# EAGLE design DroneMainBoard (EAGLE 9.6.2)

## Sheet 1 of 5
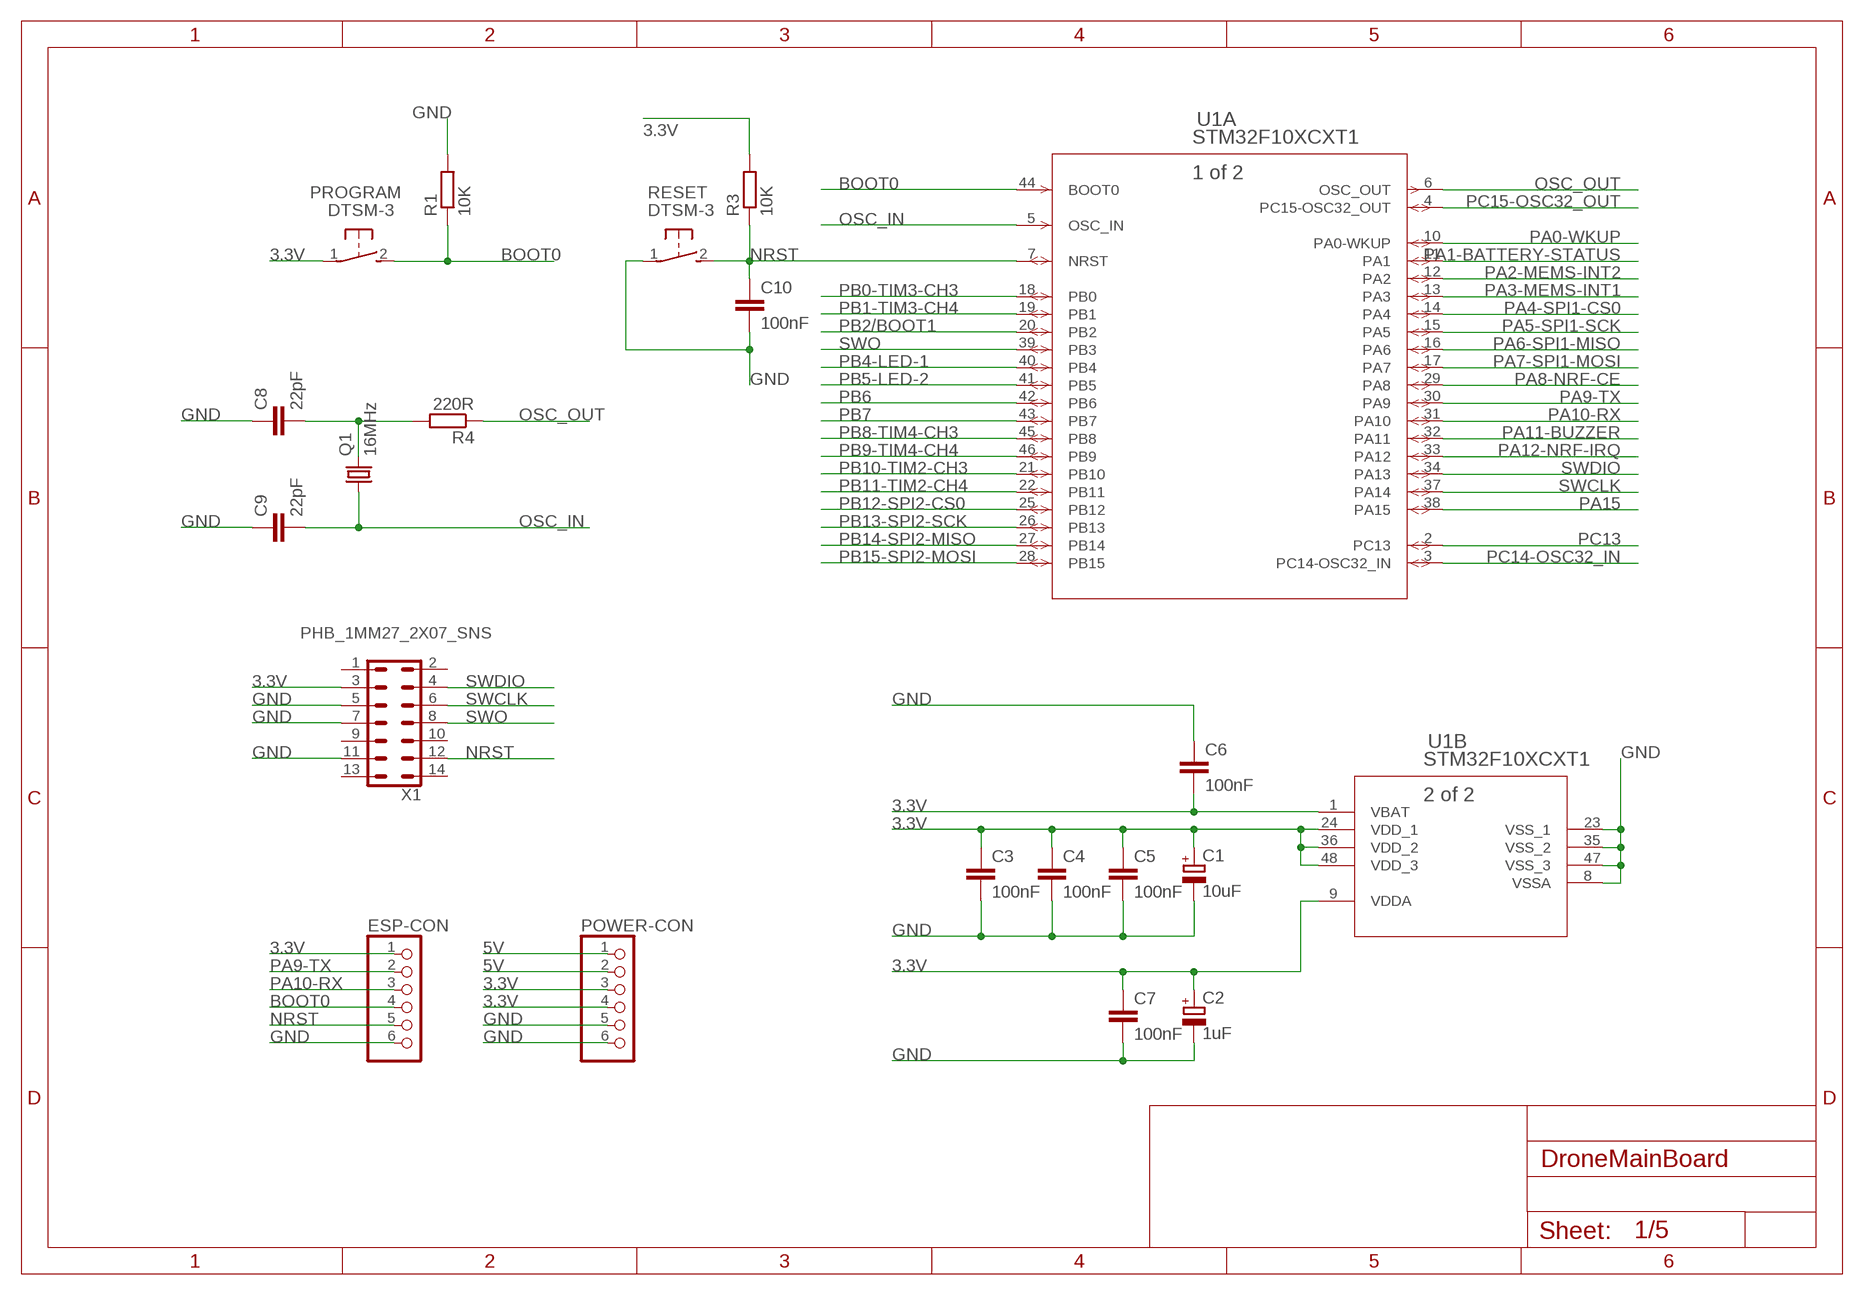
[diagram p0: schematic, sheet 1]

### Parts
C1  10uF  CPOL-EUSMCA  [SMC_A]
C2  1uF  CPOL-EUSMCA  [SMC_A]
C3  100nF  C-EUC0603  [C0603]
C4  100nF  C-EUC0603  [C0603]
C5  100nF  C-EUC0603  [C0603]
C6  100nF  C-EUC0603  [C0603]
C7  100nF  C-EUC0603  [C0603]
C8  22pF  C-EUC0603  [C0603]
C9  22pF  C-EUC0603  [C0603]
C10  100nF  C-EUC0603  [C0603]
ESP-CON  PINHD-1X6  [1X06]
POWER-CON  PINHD-1X6  [1X06]
PROGRAM  DTSM-3  [DTSM-3]
Q1  16MHz  CRYSTALHC49S  [HC49/S]
R1  10K  R-EU_R0603  [R0603]
R3  10K  R-EU_R0603  [R0603]
R4  220R  R-EU_R0603  [R0603]
RESET  DTSM-3  [DTSM-3]
U1  STM32F10XCXT1  [LQFP48-7X7MM]
X1  PHB_1MM27_2X07_SNS  [PHB_1MM27_2X07_SNS]

### Nets
3.3V: C1.+ C2.+ C3.1 C4.1 C5.1 C6.2 C7.1 ESP-CON.1 POWER-CON.3 POWER-CON.4 PROGRAM.1 R3.2 U1.1(B:VBAT) U1.9(B:VDDA) U1.24(B:VDD_1) U1.36(B:VDD_2) U1.48(B:VDD_3) X1.3 ; also sheet 2,3
5V: POWER-CON.1 POWER-CON.2 ; also sheet 5
BOOT0: ESP-CON.4 PROGRAM.2 R1.1 U1.44(A:BOOT0)
GND: C1.- C2.- C3.2 C4.2 C5.2 C6.1 C7.2 C8.1 C9.1 C10.2 ESP-CON.6 POWER-CON.5 POWER-CON.6 R1.2 RESET.1 U1.8(B:VSSA) U1.23(B:VSS_1) U1.35(B:VSS_2) U1.47(B:VSS_3) X1.5 X1.7 X1.11 ; also sheet 2,3,4,5
N$5: C8.2 Q1.2 R4.2
NRST: C10.1 ESP-CON.5 R3.1 RESET.2 U1.7(A:NRST) X1.12
OSC_IN: C9.2 Q1.1 U1.5(A:OSC_IN)
OSC_OUT: R4.1 U1.6(A:OSC_OUT)
PA0-WKUP: U1.10(A:PA0-WKUP)
PA1-BATTERY-STATUS: U1.11(A:PA1) ; also sheet 4
PA2-MEMS-INT2: U1.12(A:PA2) ; also sheet 3
PA3-MEMS-INT1: U1.13(A:PA3) ; also sheet 3
PA4-SPI1-CS0: U1.14(A:PA4) ; also sheet 3
PA5-SPI1-SCK: U1.15(A:PA5) ; also sheet 3
PA6-SPI1-MISO: U1.16(A:PA6) ; also sheet 3
PA7-SPI1-MOSI: U1.17(A:PA7) ; also sheet 3
PA8-NRF-CE: U1.29(A:PA8) ; also sheet 2
PA9-TX: ESP-CON.2 U1.30(A:PA9)
PA10-RX: ESP-CON.3 U1.31(A:PA10)
PA11-BUZZER: U1.32(A:PA11) ; also sheet 5
PA12-NRF-IRQ: U1.33(A:PA12) ; also sheet 2
PA15: U1.38(A:PA15)
PB0-TIM3-CH3: U1.18(A:PB0)
PB1-TIM3-CH4: U1.19(A:PB1)
PB2/BOOT1: U1.20(A:PB2)
PB4-LED-1: U1.40(A:PB4) ; also sheet 5
PB5-LED-2: U1.41(A:PB5) ; also sheet 5
PB6: U1.42(A:PB6)
PB7: U1.43(A:PB7)
PB8-TIM4-CH3: U1.45(A:PB8) ; also sheet 5
PB9-TIM4-CH4: U1.46(A:PB9) ; also sheet 5
PB10-TIM2-CH3: U1.21(A:PB10) ; also sheet 5
PB11-TIM2-CH4: U1.22(A:PB11) ; also sheet 5
PB12-SPI2-CS0: U1.25(A:PB12) ; also sheet 2
PB13-SPI2-SCK: U1.26(A:PB13) ; also sheet 2
PB14-SPI2-MISO: U1.27(A:PB14) ; also sheet 2
PB15-SPI2-MOSI: U1.28(A:PB15) ; also sheet 2
PC13: U1.2(A:PC13)
PC14-OSC32_IN: U1.3(A:PC14-OSC32_IN)
PC15-OSC32_OUT: U1.4(A:PC15-OSC32_OUT)
SWCLK: U1.37(A:PA14) X1.6
SWDIO: U1.34(A:PA13) X1.4
SWO: U1.39(A:PB3) X1.8
Unconnected: X1.1 X1.2 X1.9 X1.10 X1.13 X1.14

## Sheet 2 of 5
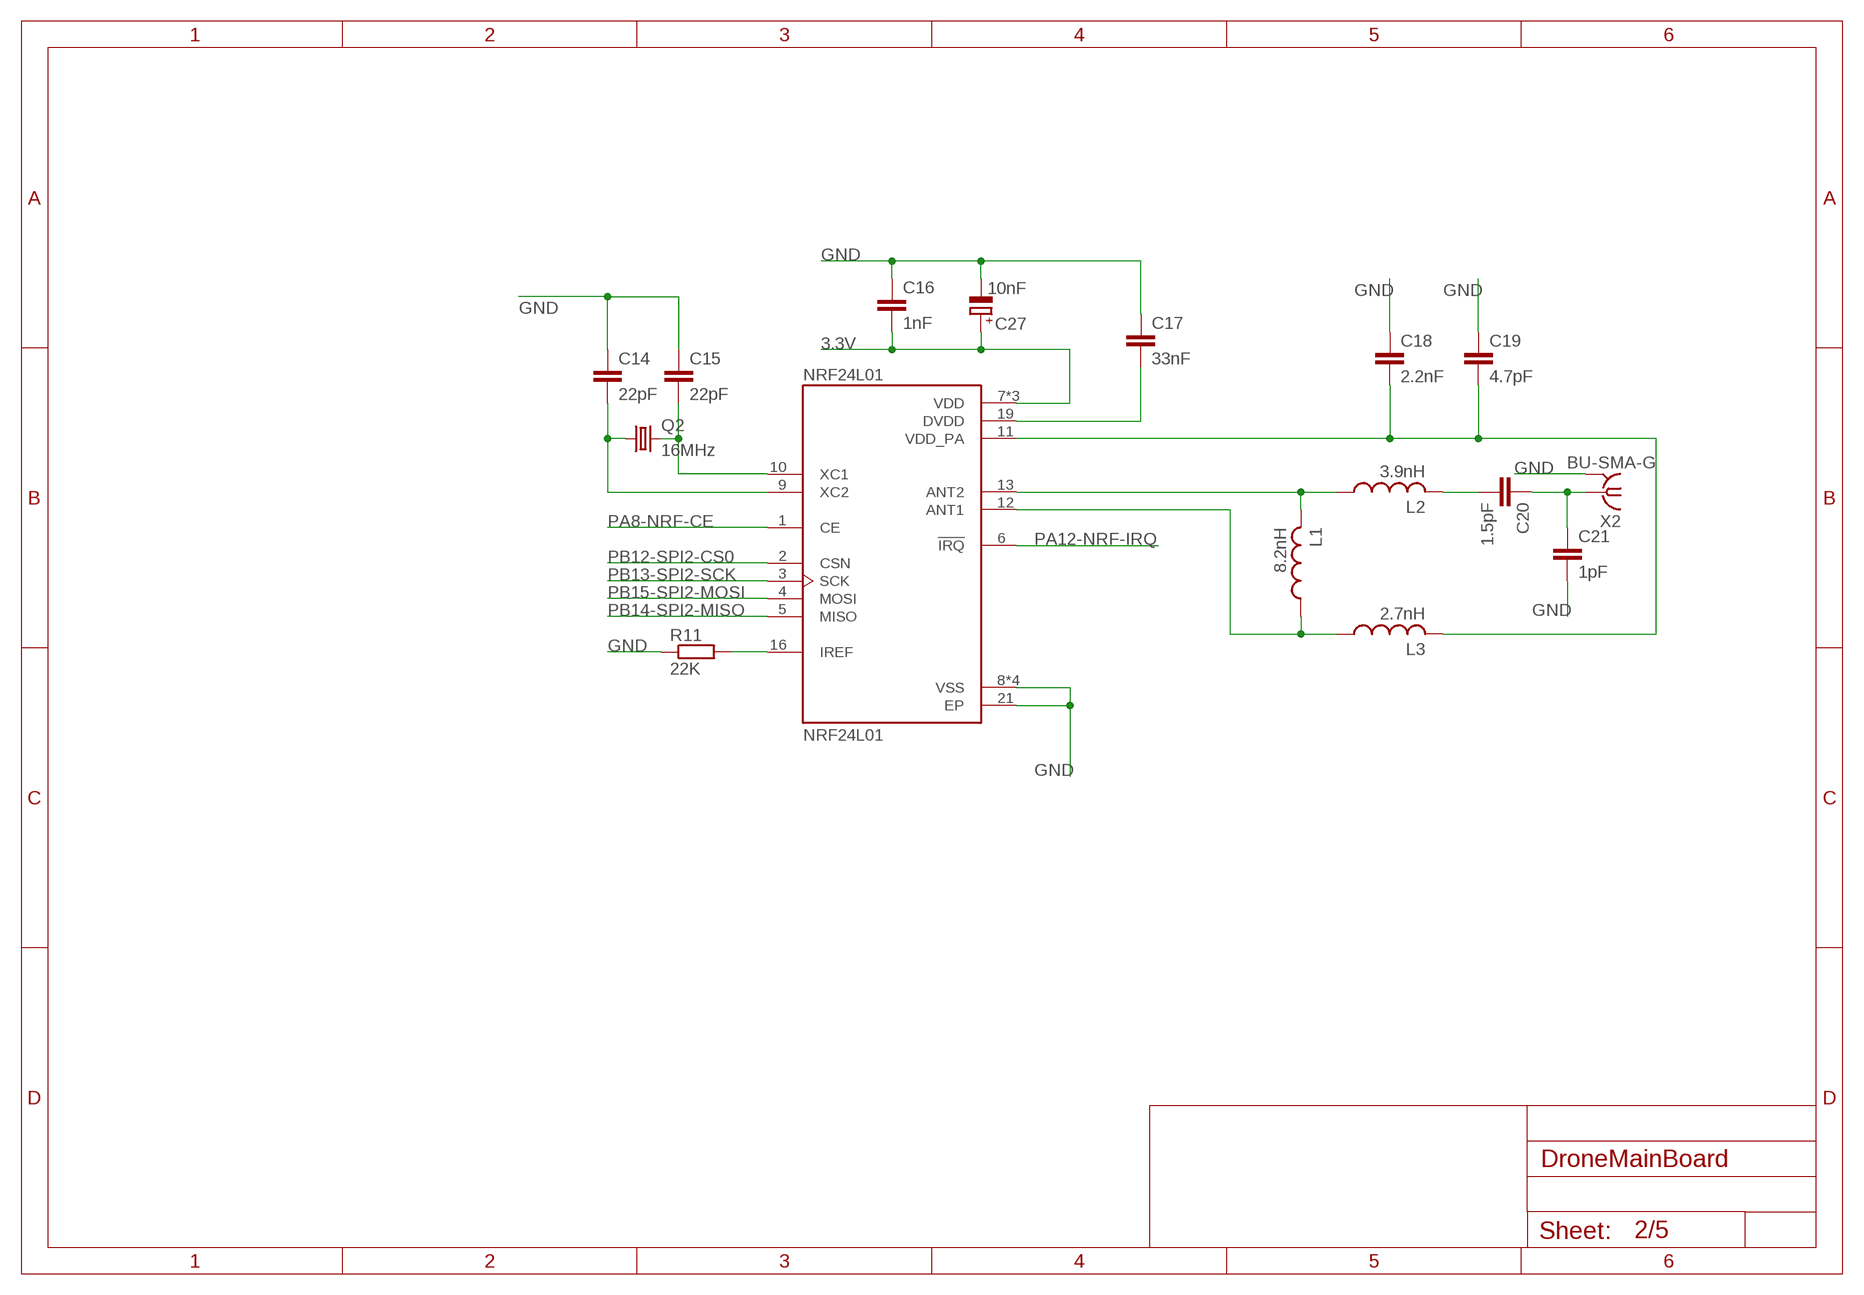
[diagram p1: schematic, sheet 2]

### Parts
C14  22pF  C-EUC0603  [C0603]
C15  22pF  C-EUC0603  [C0603]
C16  1nF  C-EUC0603  [C0603]
C17  33nF  C-EUC0603  [C0603]
C18  2.2nF  C-EUC0603  [C0603]
C19  4.7pF  C-EUC0603  [C0603]
C20  1.5pF  C-EUC0603  [C0603]
C21  1pF  C-EUC0603  [C0603]
C27  10nF  CPOL-EUSMCA  [SMC_A]
L1  8.2nH  L-USL2012C  [L2012C]
L2  3.9nH  L-USL2012C  [L2012C]
L3  2.7nH  L-USL2012C  [L2012C]
NRF24L01  NRF24L01  [QFN50P400X400X95-21N]
Q2  16MHz  CRYSTALHC49S  [HC49/S]
R11  22K  R-EU_R0603  [R0603]
X2  BU-SMA-G  [BU-SMA-G]

### Nets
3.3V: C16.2 C27.+ NRF24L01.7(VDD) NRF24L01.15(VDD) NRF24L01.18(VDD) ; also sheet 1,3
GND: C14.1 C15.1 C16.1 C17.1 C18.1 C19.1 C21.2 C27.- NRF24L01.8(VSS) NRF24L01.14(VSS) NRF24L01.17(VSS) NRF24L01.20(VSS) NRF24L01.21(EP) R11.1 X2.2 X2.3 X2.4 X2.5 ; also sheet 1,3,4,5
N$7: NRF24L01.16(IREF) R11.2
N$8: C17.2 NRF24L01.19(DVDD)
N$9: L1.2 L2.1 NRF24L01.13(ANT2)
N$10: L1.1 L3.1 NRF24L01.12(ANT1)
N$11: C18.2 C19.2 L3.2 NRF24L01.11(VDD_PA)
N$12: C14.2 NRF24L01.9(XC2) Q2.1
N$13: C15.2 NRF24L01.10(XC1) Q2.2
N$14: C20.1 C21.1 X2.1
N$15: C20.2 L2.2
PA8-NRF-CE: NRF24L01.1(CE) ; also sheet 1
PA12-NRF-IRQ: NRF24L01.6(!IRQ) ; also sheet 1
PB12-SPI2-CS0: NRF24L01.2(CSN) ; also sheet 1
PB13-SPI2-SCK: NRF24L01.3(SCK) ; also sheet 1
PB14-SPI2-MISO: NRF24L01.5(MISO) ; also sheet 1
PB15-SPI2-MOSI: NRF24L01.4(MOSI) ; also sheet 1

## Sheet 3 of 5
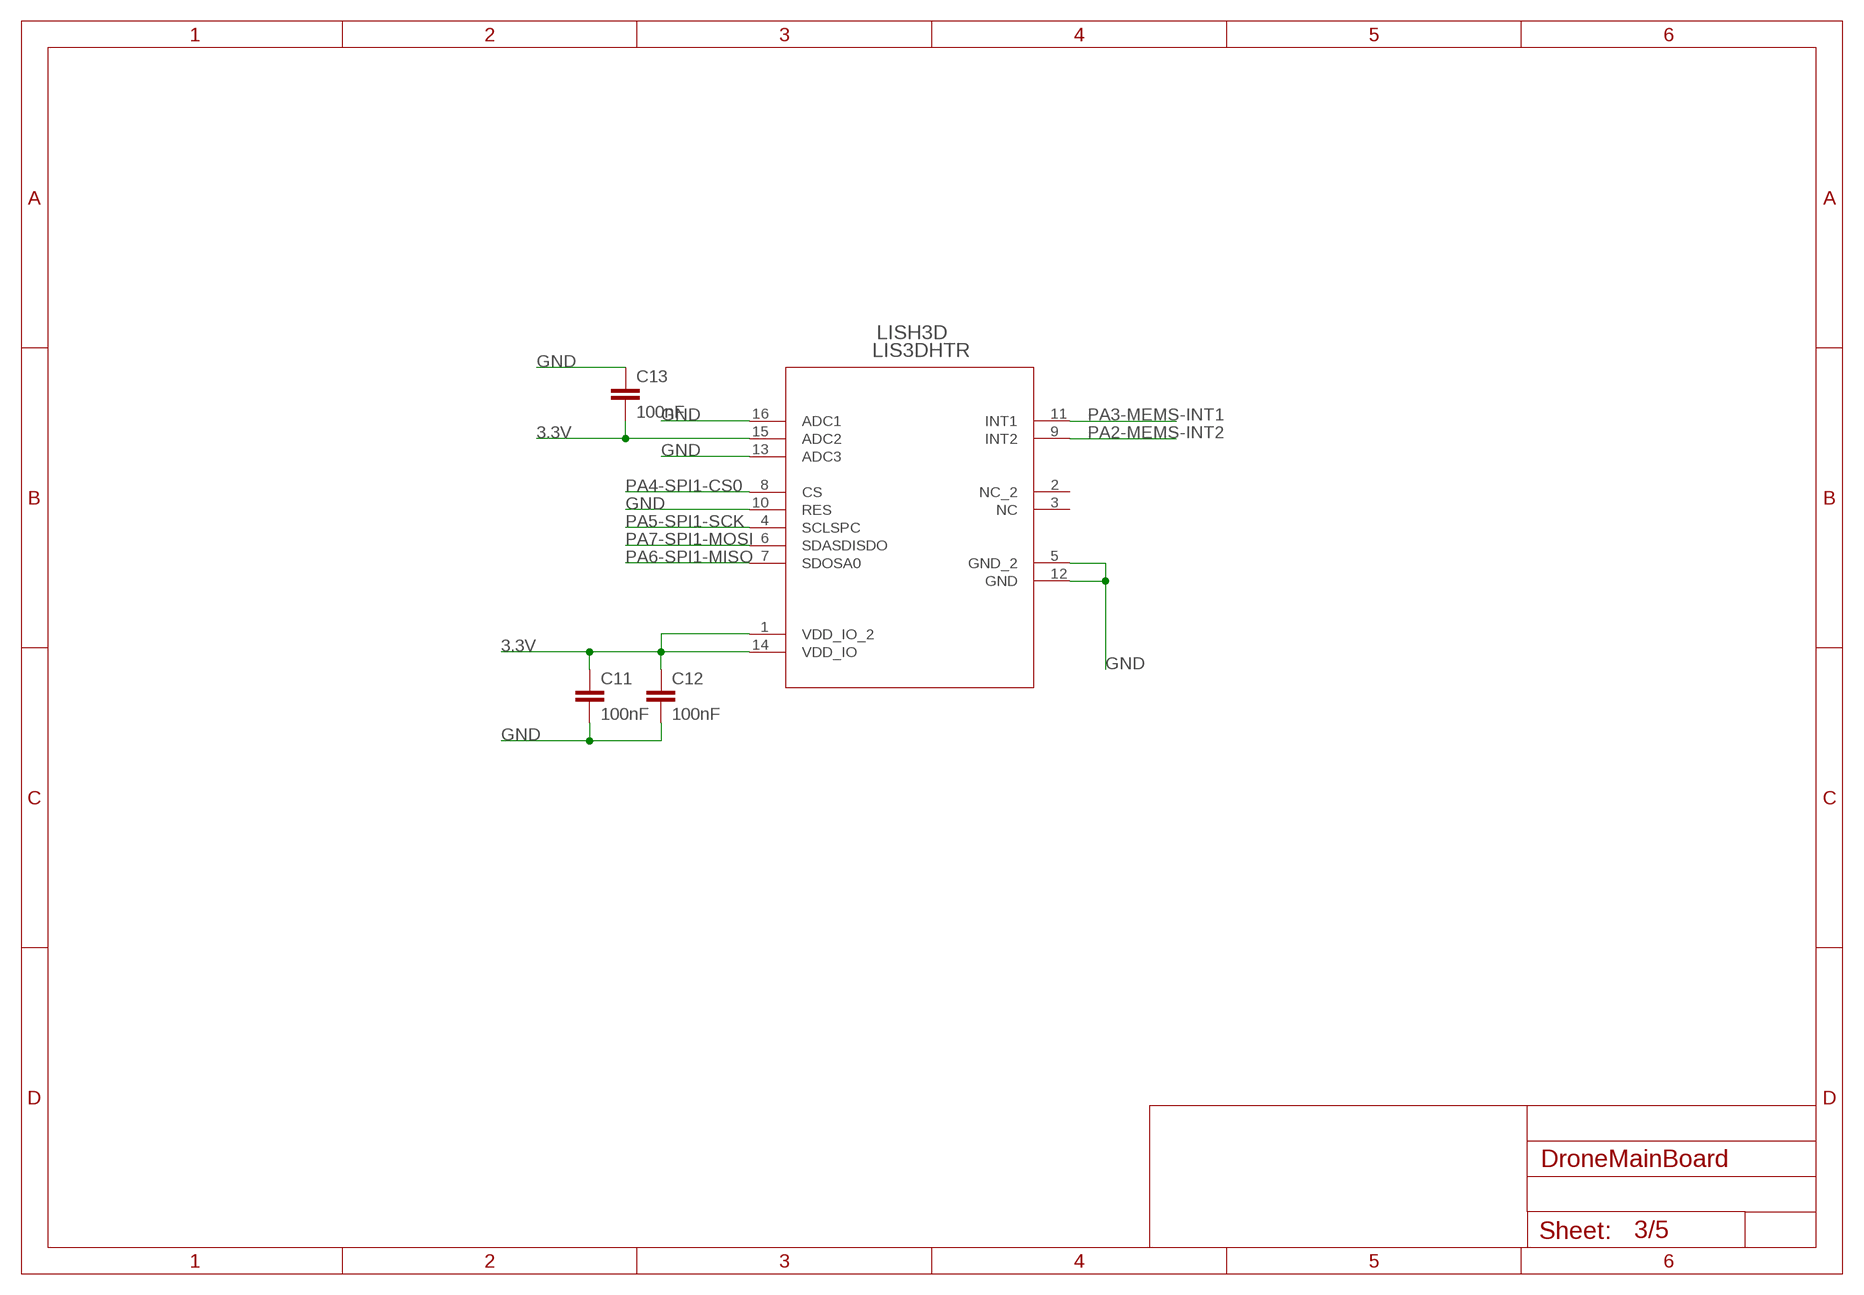
[diagram p2: schematic, sheet 3]

### Parts
C11  100nF  C-EUC0603  [C0603]
C12  100nF  C-EUC0603  [C0603]
C13  100nF  C-EUC0603  [C0603]
LISH3D  LIS3DHTR  [LGA-16_3X3X1MM_STM]

### Nets
3.3V: C11.1 C12.1 C13.2 LISH3D.1(VDD_IO_2) LISH3D.14(VDD_IO) LISH3D.15(ADC2) ; also sheet 1,2
GND: C11.2 C12.2 C13.1 LISH3D.5(GND_2) LISH3D.10(RES) LISH3D.12(GND) LISH3D.13(ADC3) LISH3D.16(ADC1) ; also sheet 1,2,4,5
PA2-MEMS-INT2: LISH3D.9(INT2) ; also sheet 1
PA3-MEMS-INT1: LISH3D.11(INT1) ; also sheet 1
PA4-SPI1-CS0: LISH3D.8(CS) ; also sheet 1
PA5-SPI1-SCK: LISH3D.4(SCLSPC) ; also sheet 1
PA6-SPI1-MISO: LISH3D.7(SDOSA0) ; also sheet 1
PA7-SPI1-MOSI: LISH3D.6(SDASDISDO) ; also sheet 1
Unconnected: LISH3D.2(NC_2) LISH3D.3(NC)

## Sheet 4 of 5
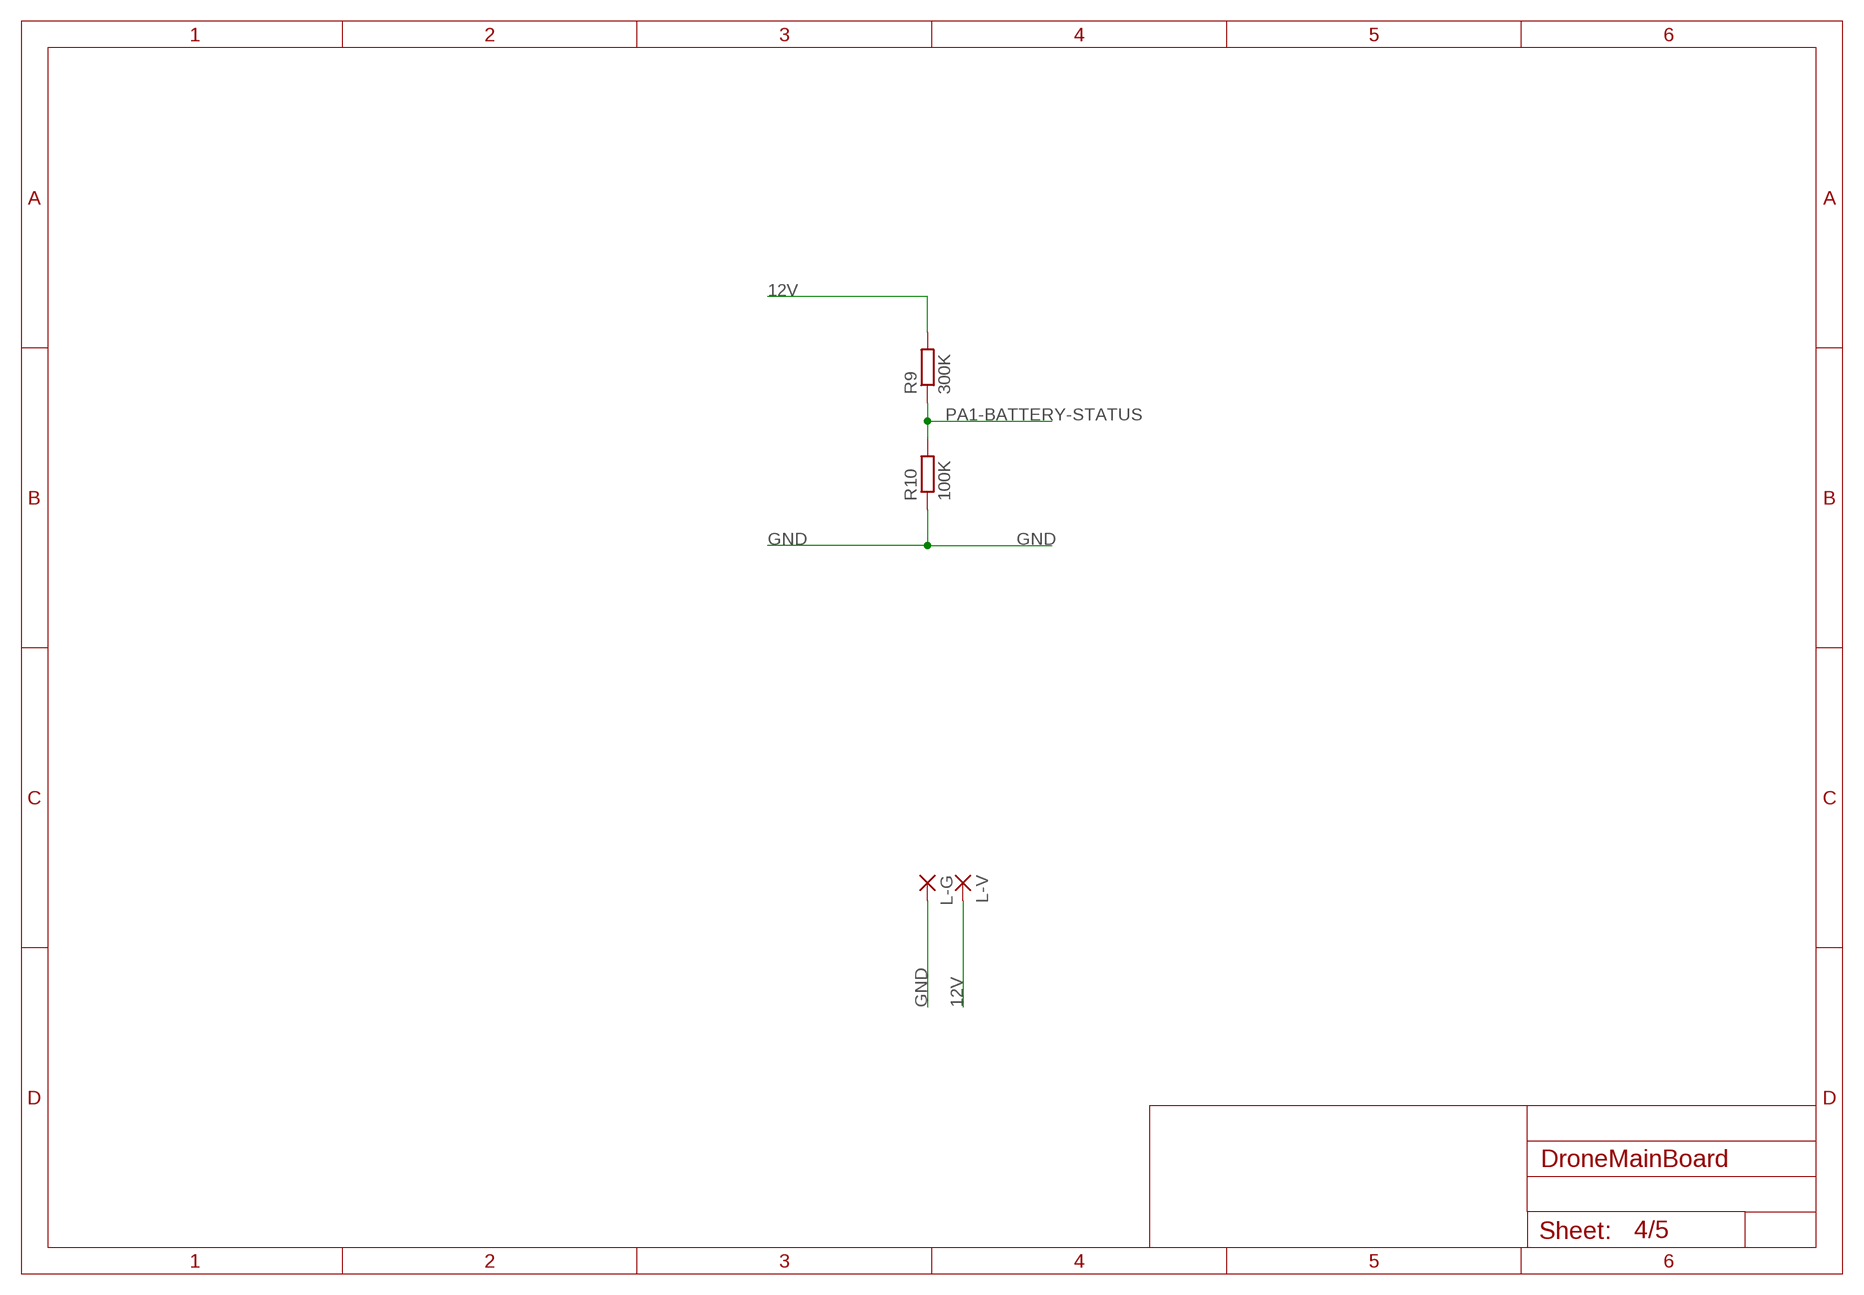
[diagram p3: schematic, sheet 4]

### Parts
L-G  2,54/1,1  [2,54/1,1]
L-V  2,54/1,1  [2,54/1,1]
R9  300K  R-EU_R0603  [R0603]
R10  100K  R-EU_R0603  [R0603]

### Nets
12V: L-V.1(P) R9.2
GND: L-G.1(P) R10.1 ; also sheet 1,2,3,5
PA1-BATTERY-STATUS: R9.1 R10.2 ; also sheet 1

## Sheet 5 of 5
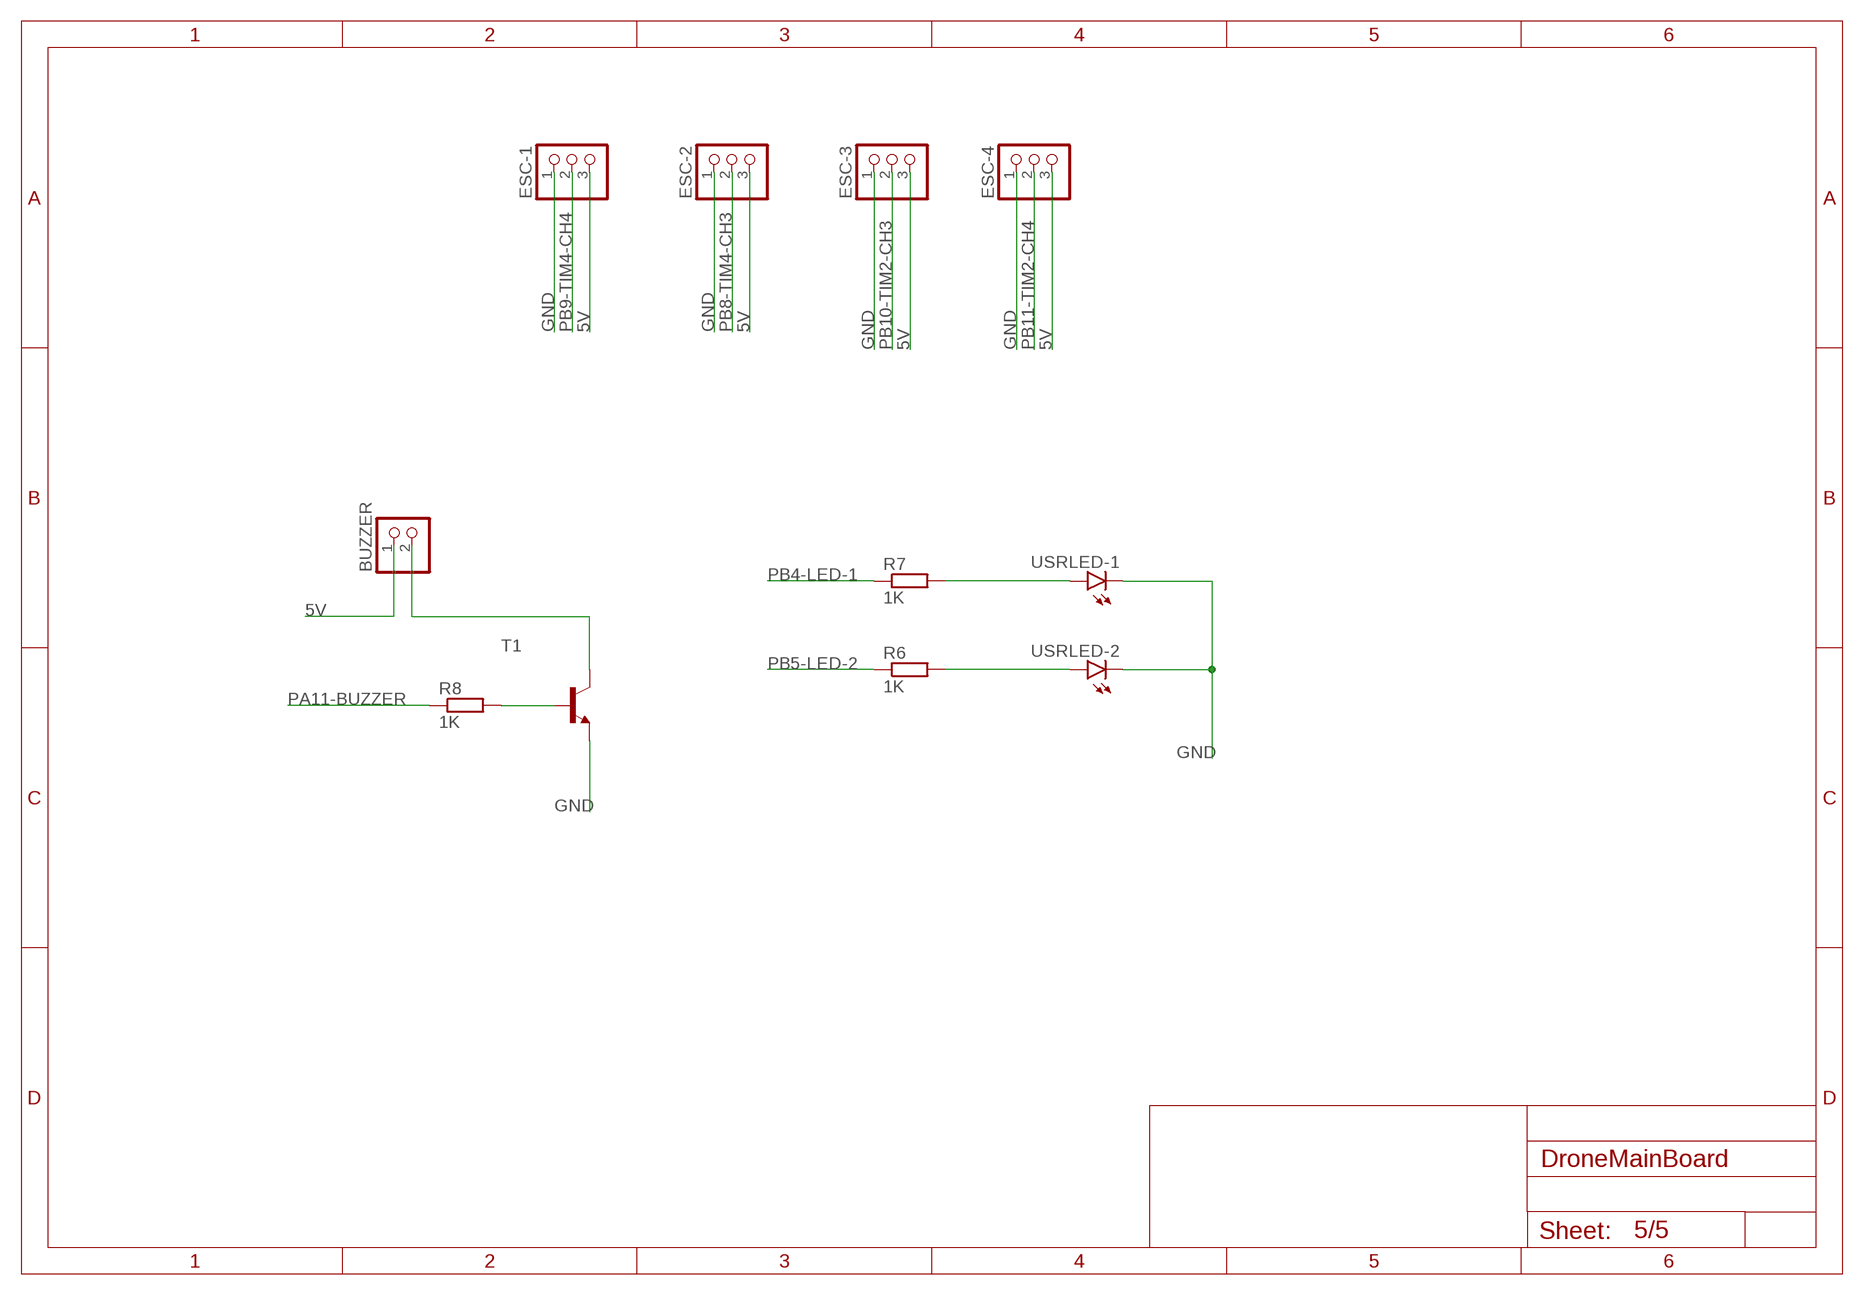
[diagram p4: schematic, sheet 5]

### Parts
BUZZER  PINHD-1X2  [1X02]
ESC-1  PINHD-1X3  [1X03]
ESC-2  PINHD-1X3  [1X03]
ESC-3  PINHD-1X3  [1X03]
ESC-4  PINHD-1X3  [1X03]
R6  1K  R-EU_R0603  [R0603]
R7  1K  R-EU_R0603  [R0603]
R8  1K  R-EU_R0603  [R0603]
T1  MMBT3904LT1-NPN-SOT23-BEC  [SOT23-BEC]
USRLED-1  LEDCHIP-LED0805  [CHIP-LED0805]
USRLED-2  LEDCHIP-LED0805  [CHIP-LED0805]

### Nets
5V: BUZZER.1 ESC-1.3 ESC-2.3 ESC-3.3 ESC-4.3 ; also sheet 1
GND: ESC-1.1 ESC-2.1 ESC-3.1 ESC-4.1 T1.E USRLED-1.C USRLED-2.C ; also sheet 1,2,3,4
N$3: R6.2 USRLED-2.A
N$4: R7.2 USRLED-1.A
N$16: BUZZER.2 T1.C
N$17: R8.2 T1.B
PA11-BUZZER: R8.1 ; also sheet 1
PB4-LED-1: R7.1 ; also sheet 1
PB5-LED-2: R6.1 ; also sheet 1
PB8-TIM4-CH3: ESC-2.2 ; also sheet 1
PB9-TIM4-CH4: ESC-1.2 ; also sheet 1
PB10-TIM2-CH3: ESC-3.2 ; also sheet 1
PB11-TIM2-CH4: ESC-4.2 ; also sheet 1

## Library data of the parts
BUZZER = pinhead:PINHD-1X2: PIN HEADER
C1 C2 C27 = rcl:CPOL-EU: POLARIZED CAPACITOR, European symbol; SPICEPREFIX: C
C3-C21 = rcl:C-EU: CAPACITOR, European symbol; SPICEPREFIX: C
ESC-1-ESC-4 = pinhead:PINHD-1X3: PIN HEADER
ESP-CON POWER-CON = pinhead:PINHD-1X6: PIN HEADER
L1-L3 = rcl:L-US: INDUCTOR, American symbol; SPICEPREFIX: L
L-G L-V = wirepad:2,54/1,1: THROUGH-HOLE PAD
LISH3D = LIS3DH:LIS3DHTR; BUILT_BY: EMA_UL_Team; MANUFACTURER_PART_NUMBER: LIS3DHTR; SOURCELIBRARY: StMicro_2015-03-30; VENDOR: STMicroelectronics
NRF24L01 = NRF24L01:NRF24L01: The nRF24L01 is a single chip 2.4GHz transceiver with an embedded baseband protocol engine (Enhanced ShockBurst™), designed for ultra low power wireless applications. The nRF24L01 is designed for operation in the world wide ISM frequency band at 2.400 - 2.4835GHz. An MCU (microcontroller) and very few external passive components are needed to design a radio system with the nRF24L01. The nRF24L01 is configured and operated through a Serial Peripheral Interface (SPI.) Through this interface the register map is available. The register map contains all configuration registers in the nRF24L01 and is accessible in all operation modes of the chip. Buy Part <https://snapeda.com/parts/NRF24L01/Nordic/view-part/?ref=eda>; AVAILABILITY: Warning; DESCRIPTION: IC RF TxRx Only General ISM > 1GHZ 2.4GHz 20-VFQFN Exposed Pad; MF: Nordic; MOUSER-PURCHASE-URL: https://snapeda.com/shop?store=Mouser&id=44833; MP: NRF24L01; PACKAGE: VFQFN-20 Nordic Semiconductor; PRICE: None
PROGRAM RESET = switch-tact:DTSM-3
Q1 Q2 = crystal:CRYSTAL: CRYSTAL; OC_FARNELL: 1667008; OC_NEWARK: unknown
R1 R3 R4 R6-R11 = rcl:R-EU_: RESISTOR, European symbol; SPICEPREFIX: R
T1 = transistor:*-NPN-: NPN Transistror BF959 corrected 2008.03.06
U1 = STM32F10XCXT1:STM32F10XCXT1; COPYRIGHT: Copyright (C) 2016 Accelerated Designs. All rights reserved; MANUFACTURER_PART_NUMBER: STM32F10XCXT1; VENDOR: STMicroelectronics
USRLED-1 USRLED-2 = led:LED: LED OSRAM: - CHIPLED LG R971, LG N971, LY N971, LG Q971, LY Q971, LO R971, LY R971 LH N974, LH R974 LS Q976, LO Q976, LY Q976 LO Q996 - Hyper CHIPLED LW Q18S LB Q993, LB Q99A, LB R99A - SideLED LS A670, LO A670, LY A670, LG A670, LP A670 LB A673, LV A673, LT A673, LW A673 LH A674 LY A675 LS A676, LA A676, LO A676, LY A676, LW A676 LS A679, LY A679, LG A679 - Hyper Micro SIDELED® LS Y876, LA Y876, LO Y876, LY Y876 LT Y87S - SmartLED LW L88C, LW L88S LB L89C, LB L89S, LG L890 LS L89K, LO L89K, LY L89K LS L896, LA L896, LO L896, LY L896 - TOPLED LS T670, LO T670, LY T670, LG T670, LP T670 LSG T670, LSP T670, LSY T670, LOP T670, LYG T670 LG T671, LOG T671, LSG T671 LB T673, LV T673, LT T673, LW T673 LH T674 LS T676, LA T676, LO T676, LY T676, LB T676, LH T676, LSB T676, LW T676 LB T67C, LV T67C, LT T67C, LS T67K, LO T67K, LY T67K, LW E67C LS E67B, LA E67B, LO E67B, LY E67B, LB E67C, LV E67C, LT E67C LW T67C LS T679, LY T679, LG T679 LS T770, LO T770, LY T770, LG T770, LP T770 LB T773, LV T773, LT T773, LW T773 LH T774 LS E675, LA E675, LY E675, LS T675 LS T776, LA T776, LO T776, LY T776, LB T776 LHGB T686 LT T68C, LB T68C - Hyper Mini TOPLED® LB M676 - Mini TOPLED Santana® LG M470 LS M47K, LO M47K, LY M47K Source: http://www.osram.convergy.de LUXEON: - LUMILED® LXK2-PW12-R00, LXK2-PW12-S00, LXK2-PW14-U00, LXK2-PW14-V00 LXK2-PM12-R00, LXK2-PM12-S00, LXK2-PM14-U00 LXK2-PE12-Q00, LXK2-PE12-R00, LXK2-PE12-S00, LXK2-PE14-T00, LXK2-PE14-U00 LXK2-PB12-K00, LXK2-PB12-L00, LXK2-PB12-M00, LXK2-PB14-N00, LXK2-PB14-P00, LXK2-PB14-Q00 LXK2-PR12-L00, LXK2-PR12-M00, LXK2-PR14-Q00, LXK2-PR14-R00 LXK2-PD12-Q00, LXK2-PD12-R00, LXK2-PD12-S00 LXK2-PH12-R00, LXK2-PH12-S00 LXK2-PL12-P00, LXK2-PL12-Q00, LXK2-PL12-R00 Source: www.luxeon.com KINGBRIGHT: KA-3528ASYC Source: www.kingbright.com
X1 = pinhead-box-1.27mm:PHB_1MM27_2X07_*: Pin Header Box-Type, 1.27mm/0.5"/50mil Pitch, 2x07 Circuits Note: see library description for an important note about THT-version
X2 = con-coax:BU-SMA-G: FEMALE SMA CONNECTOR Radiall distributor RS 193-9117; OC_FARNELL: unknown; OC_NEWARK: unknown

## Board
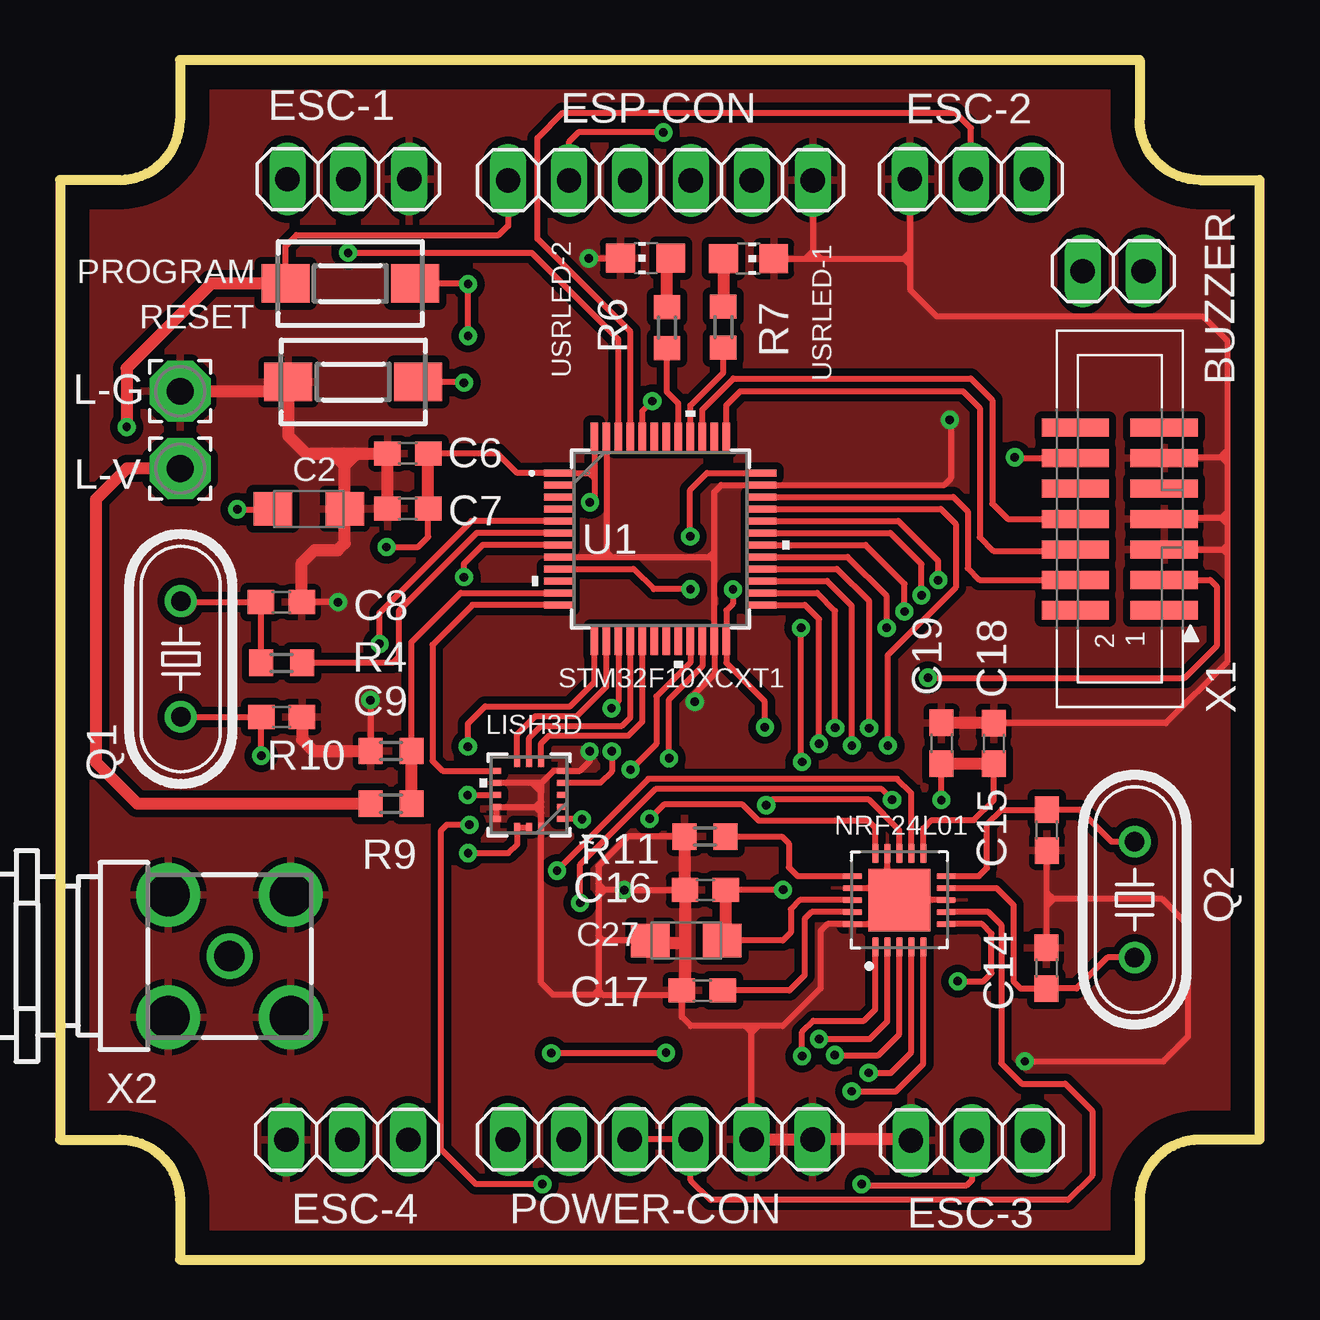
[diagram p5: board, top side]
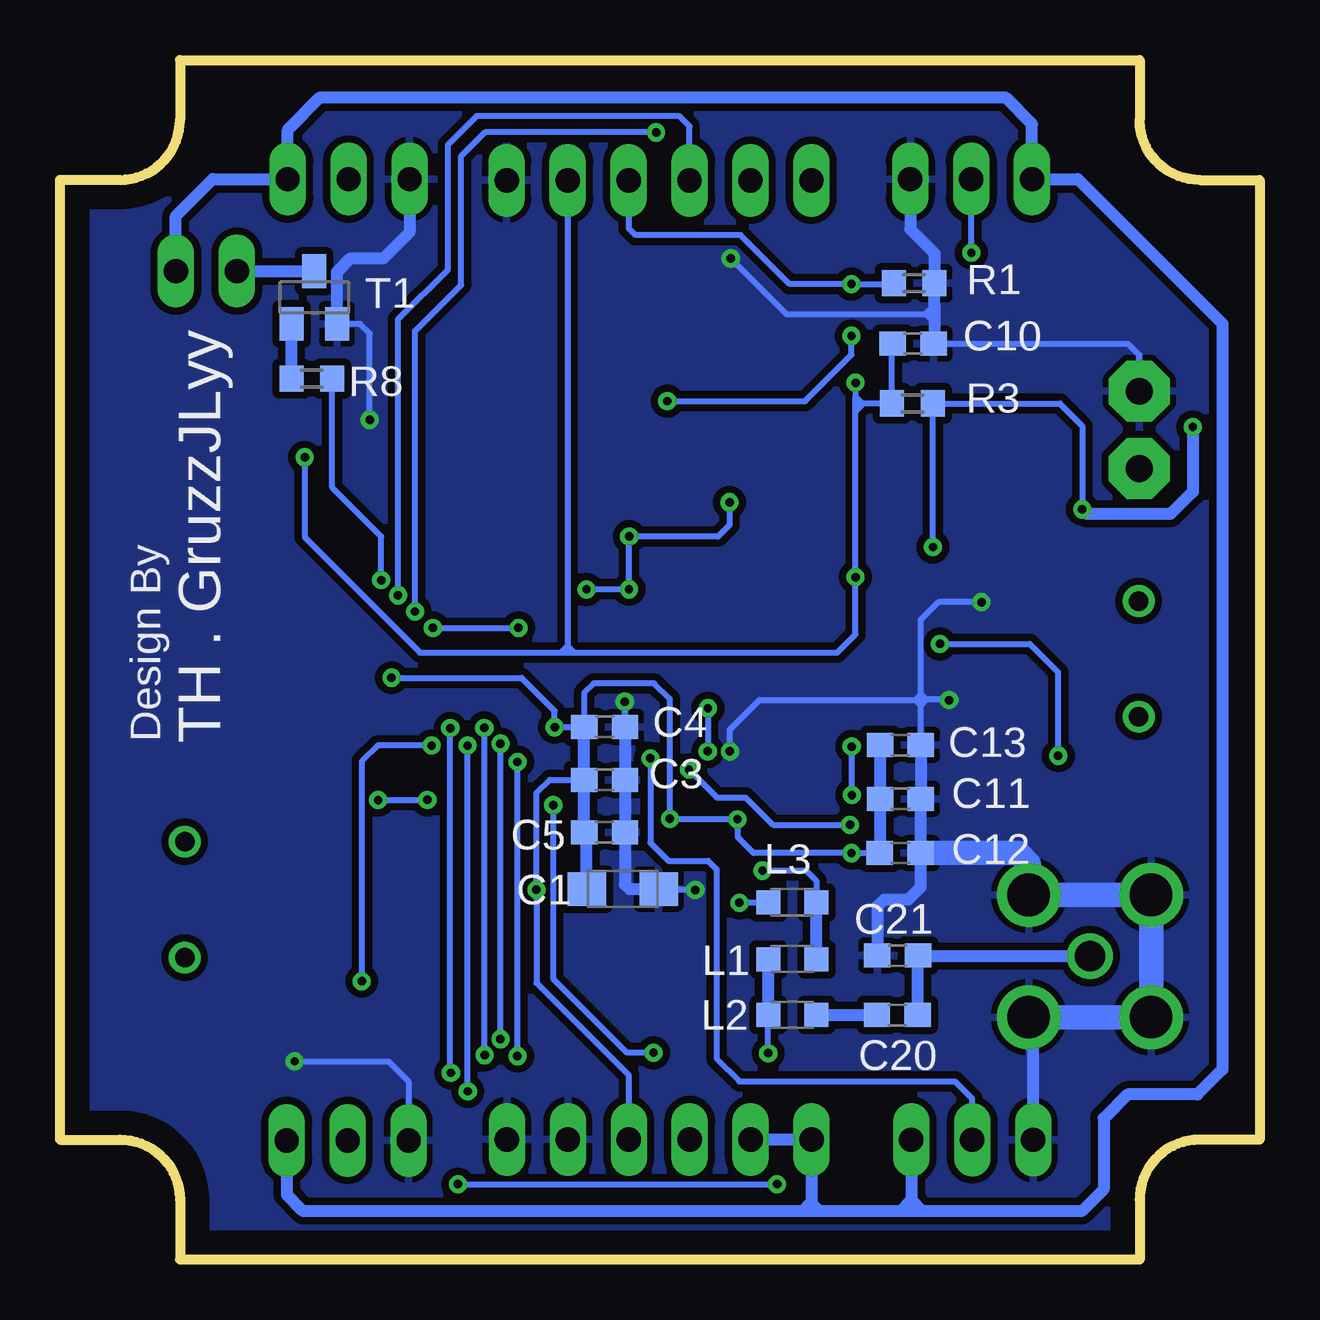
[diagram p6: board, bottom side, seen from below]

Size 50 x 50 mm. Coordinates in mm from the lower left corner, seen from the top.
Outline: 5,0 45,0 45,2.5 arc-90 47.5,5 50,5 50,45 47.5,45 arc-90 45,47.5 45,50 5,50 5,47.5 arc-90 2.5,45 0,45 0,5 2.5,5 arc-90 5,2.5 5,0
Copper layers (1*16): Top 0.035mm / dielectric 1.5mm / Bottom 0.035mm
Design rules "default *": minimum track width 6mil, minimum drill 0.35mm, track to track 6mil, track to pad 6mil, pad to pad 6mil, via to via 6mil, smd to smd 6mil, copper to edge 40mil, drill to drill 6mil, minimum pad ring 10mil, minimum via ring 8mil, stop-mask expansion 4mil, vias tented up to drill 0mil, thermal gap 10mil

### Footprints (pad centres in the part's own frame; a part is rotated, then mirrored left to right if it is on the bottom)
1X02 = drill 1.016 long: 1 -1.27,0; 2 1.27,0
SMC_A = smd 1.6 x 1.4: + -1.5,0; - 1.5,0
C0603 = smd 1.1 x 1: 1 -0.85,0; 2 0.85,0
1X03 = drill 1.016 long: 1 -2.54,0; 2 0,0; 3 2.54,0
1X06 = drill 1.016 long: 1 -6.35,0; 2 -3.81,0; 3 -1.27,0; 4 1.27,0; 5 3.81,0; 6 6.35,0
L2012C = smd 1 x 1: 1 -1,0; 2 1,0
2,54/1,1 = drill 1.118 pad 2.54 octagon: 1 0,0
LGA-16_3X3X1MM_STM = smd 0.356 x 0.254: 1 -1.346,1; 2 -1.346,0.5; 3 -1.346,0; 4 -1.346,-0.5; 5 -1.346,-1; 9 1.346,-1; 10 1.346,-0.5; 11 1.346,0; 12 1.346,0.5; 13 1.346,1 | smd 0.254 x 0.356: 6 -0.5,-1.346; 7 0,-1.346; 8 0.5,-1.346; 14 0.5,1.346; 15 0,1.346; 16 -0.5,1.346
QFN50P400X400X95-21N = smd 0.81 x 0.26: 1 -1.95,1; 2 -1.95,0.5; 3 -1.95,0; 4 -1.95,-0.5; 5 -1.95,-1; 11 1.95,-1; 12 1.95,-0.5; 13 1.95,0; 14 1.95,0.5; 15 1.95,1 | smd 0.26 x 0.81: 6 -1,-1.95; 7 -0.5,-1.95; 8 0,-1.95; 9 0.5,-1.95; 10 1,-1.95; 16 1,1.95; 17 0.5,1.95; 18 0,1.95; 19 -0.5,1.95; 20 -1,1.95 | smd 2.6 x 2.6: 21 0,0
DTSM-3 = smd 2 x 1.6: 1 -2.7,0; 2 2.7,0
HC49/S = drill 0.813: 1 -2.413,0; 2 2.413,0
R0603 = smd 1 x 1.1: 1 -0.85,0; 2 0.85,0
SOT23-BEC = smd 1 x 1.4: B -0.95,-1.1; C 0,1.1; E 0.95,-1.1
LQFP48-7X7MM = smd 1.194 x 0.305: 1 -4.25,2.75; 2 -4.25,2.25; 3 -4.25,1.75; 4 -4.25,1.25; 5 -4.25,0.75; 6 -4.25,0.25; 7 -4.25,-0.25; 8 -4.25,-0.75; 9 -4.25,-1.25; 10 -4.25,-1.75; 11 -4.25,-2.25; 12 -4.25,-2.75; 25 4.25,-2.75; 26 4.25,-2.25; 27 4.25,-1.75; 28 4.25,-1.25; 29 4.25,-0.75; 30 4.25,-0.25; 31 4.25,0.25; 32 4.25,0.75; 33 4.25,1.25; 34 4.25,1.75; 35 4.25,2.25; 36 4.25,2.75 | smd 0.305 x 1.194: 13 -2.75,-4.25; 14 -2.25,-4.25; 15 -1.75,-4.25; 16 -1.25,-4.25; 17 -0.75,-4.25; 18 -0.25,-4.25; 19 0.25,-4.25; 20 0.75,-4.25; 21 1.25,-4.25; 22 1.75,-4.25; 23 2.25,-4.25; 24 2.75,-4.25; 37 2.75,4.25; 38 2.25,4.25; 39 1.75,4.25; 40 1.25,4.25; 41 0.75,4.25; 42 0.25,4.25; 43 -0.25,4.25; 44 -0.75,4.25; 45 -1.25,4.25; 46 -1.75,4.25; 47 -2.25,4.25; 48 -2.75,4.25
CHIP-LED0805 = smd 1.2 x 1.2: A 0,-1.05; C 0,1.05
PHB_1MM27_2X07_SNS = smd 0.76 x 2.8: 1 -3.81,-1.85; 2 -3.81,1.85; 3 -2.54,-1.85; 4 -2.54,1.85; 5 -1.27,-1.85; 6 -1.27,1.85; 7 0,-1.85; 8 0,1.85; 9 1.27,-1.85; 10 1.27,1.85; 11 2.54,-1.85; 12 2.54,1.85; 13 3.81,-1.85; 14 3.81,1.85
BU-SMA-G = drill 1.27: 1 0,0 | drill 1.778: 2 -2.55,2.55; 3 2.55,2.55; 4 2.55,-2.55; 5 -2.55,-2.55

### Placement (x,y rotation side)
BUZZER  43.9,41.2 180 top
C1  26.55,15.44 0 bottom
C2  10.37,31.29 0 top
C3  27.3,20 0 bottom
C4  27.3,22.2 0 bottom
C5  27.3,17.8 0 bottom
C6  14.5,33.6 0 top
C7  14.5,31.3 180 top
C8  9.23,27.4 180 top
C9  9.24,22.62 180 top
C10  14.44,38.17 0 bottom
C11  14.97,19.2 0 bottom
C12  14.98,16.94 0 bottom
C13  14.97,21.45 180 bottom
C14  41.11,12.15 270 top
C15  41.14,17.9 90 top
C16  26.9,15.4 0 top
C17  26.77,11.21 0 top
C18  38.92,21.51 270 top
C19  36.74,21.52 270 top
C20  15.1,10.2 180 bottom
C21  15.08,12.68 180 bottom
C27  26.1,13.3 180 top
ESC-1  12.02,45.03 180 top
ESC-2  37.97,45.03 0 top
ESC-3  38.01,4.96 0 top
ESC-4  11.97,4.99 0 top
ESP-CON  25.03,44.98 0 top
L1  19.47,12.52 180 bottom
L2  19.47,10.2 0 bottom
L3  19.47,14.89 180 bottom
L-G  5.01,36.19 0 top
L-V  5.01,32.97 0 top
LISH3D  19.55,19.37 180 top
NRF24L01  34.99,14.98 90 top
POWER-CON  25.02,5.01 0 top
PROGRAM  12.1,40.68 0 top
Q1  5.04,25.03 90 top
Q2  44.8,15 90 top
R1  14.4,40.7 0 bottom
R3  14.47,35.68 0 bottom
R4  9.24,24.87 180 top
R6  25.3,38.84 90 top
R7  27.65,38.86 90 top
R8  39.5,36.72 180 bottom
R9  13.8,19 180 top
R10  13.8,21.2 0 top
R11  26.89,17.63 0 top
RESET  12.22,36.58 0 top
T1  39.4,40.1 0 bottom
U1  25.02,30.03 0 top
USRLED-1  28.7,41.72 270 top
USRLED-2  24.41,41.74 90 top
X1  44.17,30.87 90 top
X2  7.07,12.65 180 top

### Tracks (layer width: path | path; a pad name or v marks a point on that pad's centre or on a via)
3.3V  (via drill 0.35)
  Top 0.254: LISH3D.15 LISH3D.14 19.05,17.31 18.68,16.94 17.03,16.94 | NRF24L01.18 30.84,14.98 30.46,14.6 30.46,13.63 30.13,13.3 C27.+ | NRF24L01.7 38.71,14.48 39.23,13.96 39.23,8.19 40.09,7.33 41.9,7.33 43.03,6.2 43.03,3.5 42.01,2.48 27.12,2.48 26.29,3.31 POWER-CON.4 | 26.25,5.01 23.79,5.01 | 30.06,15.4 C16.2 | NRF24L01.15 33.99,17.98 33.69,18.28 29.13,18.28 28.45,18.96 25.17,18.96 v24.59,18.38 | 21.74,18.37 LISH3D.1 | 29.38,22.22 29.38,23.26 27.77,24.87 U1.24 27.77,27.05 28.05,27.33 28.05,27.9 | X1.3 47.94,28.33 48.21,28.06 48.21,25.57 46.89,24.25 36.2,24.25 | U1.48 22.27,33.02 | 22.04,32.78 U1.1 19.05,32.78 18.24,33.6 C6.2 | 22.27,33.02 22.04,32.78 | U1.9 23.91,28.79 24.75,27.94 26.24,27.94 | 26.27,30.18 26.27,32.08 26.98,32.78 U1.36 | PROGRAM.1 9.4,42.24 9.86,42.7 18.29,42.7 18.68,43.09 18.68,44.88 | 22.27,33.02 22.27,32.55 | 22.27,32.55 22.27,31.74 22.11,31.59 | 22.04,32.78 22.27,32.55 | 13.64,29.7 14.93,29.7 15.35,30.12 C7.1 | 7.41,31.27 8.85,31.27 C2.+
  Top 0.508: C27.+ 27.75,13.45 C16.2 | C7.1 C6.2 | PROGRAM.1 6.31,40.68 2.78,37.15 v2.78,34.7 | v7.39,31.27 7.41,31.27 | v13.61,29.7 13.64,29.7 | v29.38,22.19 29.38,22.22 | v36.18,24.25 36.2,24.25 | v24.58,18.37 v24.59,18.38 | v21.76,18.35 21.74,18.37 | v26.28,27.94 26.24,27.94 | v28.05,27.93 28.05,27.9 | v26.27,30.14 26.27,30.18 | v22.09,31.56 22.11,31.59 | v17.01,16.94 17.03,16.94 | v30.14,15.41 v30.13,15.4 30.06,15.4
  Top 1.27: POWER-CON.3 23.79,5.01 | POWER-CON.4 26.25,5.01 | ESP-CON.1 18.68,44.88
  Bottom 0.254: v17.01,16.94 C12.1 | v30.14,15.41 30.14,19.44 29.58,20 C3.1 | v24.58,18.37 21.78,18.37 v21.76,18.35 | 21.76,18.33 21.76,17.61 21.09,16.94 17.03,16.94 | 26.29,5.12 26.29,7.68 30.14,11.53 v30.14,15.4 | 24.58,18.41 24.58,23.37 25.23,24.02 27.76,24.02 28.15,23.63 C4.1 v29.38,22.19 | 36.11,24.25 30.76,24.25 29.38,22.87 29.38,22.23 | v28.04,27.94 v26.28,27.94 | 26.28,27.97 v26.28,30.13 22.58,30.13 22.09,30.62 v22.09,31.55 | v7.39,31.27 7.39,34.75 8.32,35.68 R3.2 v13.62,29.71
  Bottom 0.508: C1.+ 28.05,17.7 C5.1 C3.1 C4.1 | C13.2 C11.1 C12.1 | v2.78,34.7 2.78,32.01 3.7,31.09 7.21,31.09 v7.39,31.27 | v13.61,29.7 v13.62,29.71 | v17.01,16.94 17.03,16.94 | v21.76,18.35 21.76,18.33 | v24.58,18.37 24.58,18.41 | v29.38,22.19 29.38,22.23 | v36.18,24.25 36.11,24.25 | v30.14,15.41 v30.14,15.4 | v22.09,31.56 v22.09,31.55 | v26.28,27.94 26.28,27.97 | v28.05,27.93 v28.04,27.94 | v26.27,30.14 v26.28,30.13
  Bottom 1.27: POWER-CON.4 26.29,5.12
5V
  Bottom 0.508: 45.17,41.23 45.17,43.49 43.63,45.03 ESC-2.3 | 40.51,45.33 40.51,47.08 39.15,48.44 10.6,48.44 9.48,47.32 9.48,45.14 | ESC-1.3 7.57,45.03 1.55,39.01 1.55,7.92 2.59,6.88 5.51,6.88 6.5,5.89 6.5,2.93 7.41,2.02 14.05,2.02 | 14.05,2.02 14.51,2.48 | 14.51,4.94 14.51,2.48 | 14.05,2.02 14.98,2.02 | 14.98,2.02 18.34,2.02 | 18.67,4.81 18.67,2.35 | 18.34,2.02 18.67,2.35 | 21.13,5.01 POWER-CON.1 | 14.51,2.48 14.98,2.02 | 18.34,2.02 19.06,2.02 | 19.06,2.02 39.86,2.02 40.55,2.71 40.55,4.81 | 18.67,2.35 18.73,2.35 19.06,2.02
  Bottom 1.27: ESC-1.3 9.48,45.14 | ESC-2.3 40.51,45.33 | BUZZER.1 45.17,41.23 | ESC-4.3 14.51,4.94 | POWER-CON.1 18.67,4.81 | POWER-CON.2 21.13,5.01 | ESC-3.3 40.55,4.81
12V
  Top 0.508: R9.2 3.23,19 1.51,20.72 1.51,31.69 2.79,32.97 4.94,32.97
  Top 1.27: L-V.1 4.94,32.97
BOOT0  (via drill 0.35)
  Top 0.254: 16.99,40.68 PROGRAM.2 | U1.44 24.27,35.36 v24.68,35.77 | 17.01,38.52 v17.01,40.66
  Top 0.508: v17.01,38.5 17.01,38.52 | v17.01,40.66 16.99,40.68 | v24.69,35.78 v24.68,35.77
  Bottom 0.254: v17.01,40.66 15.29,40.66 R1.1 | 17.04,40.66 19.59,40.66 21.63,42.7 26.01,42.7 26.3,42.99 26.3,44.8 | v24.68,35.78 18.94,35.78 17.01,37.71 v17.01,38.49
  Bottom 0.508: v17.01,40.66 17.04,40.66 | v17.01,38.5 v17.01,38.49 | v24.69,35.78 v24.68,35.78
  Bottom 1.27: ESP-CON.4 26.3,44.8
GND  (via drill 0.35)
  Top 0.254: R11.1 23.67,17.63 22.44,16.4 22.44,15.66 | 22.61,11.04 22.44,11.21 | 22.61,11.04 25.75,11.04 C17.1 25.92,10.11 26.3,9.73 28.55,9.73 | 22.44,15.66 22.44,15.36 | 22.44,15.36 22.44,15.19 | 22.44,15.19 22.44,13.5 | 22.44,13.5 22.44,13.31 | 22.44,13.31 22.44,13.09 | 22.44,13.09 22.44,11.21 | C27.- 22.64,13.3 | 22.64,13.3 22.45,13.3 22.44,13.31 | 22.64,13.3 22.44,13.5 | 22.64,13.3 22.64,13.29 22.44,13.09 | v23.53,15.4 C16.1 | v23.52,15.4 22.7,15.4 | 22.7,15.4 22.48,15.4 22.44,15.36 | 22.7,15.4 22.44,15.66 | 22.7,15.4 22.49,15.19 22.44,15.19 | 22.61,11.04 22.25,11.04 | 22.25,11.04 20.55,11.04 20.05,11.54 LISH3D.16 20.05,18.63 | 22.44,11.21 22.42,11.21 22.25,11.04 | 20.05,18.63 20.05,18.88 | 20.05,18.88 20.05,19.09 | 20.05,19.09 20.05,19.49 | 19.67,19.87 LISH3D.10 | 20.05,19.49 19.83,19.71 | 19.83,19.71 19.67,19.87 | 19.67,19.87 20.07,19.87 | 19.83,19.71 19.91,19.71 20.05,19.85 | 20.07,19.87 20.57,20.36 LISH3D.5 21.68,20.37 22.08,20.77 22.08,21.13 | 20.07,19.87 20.05,19.85 | 20.05,19.85 20.05,19.49 | LISH3D.13 LISH3D.12 19.82,18.87 | 19.83,18.87 20.04,18.87 20.05,18.88 | 19.82,18.87 19.83,18.87 | 19.83,18.87 20.05,19.09 | 19.82,18.87 20.05,18.63 | 34.49,15.53 NRF24L01.14 | 34.99,15.03 NRF24L01.21 | 34.49,15.53 34.99,15.03 | NRF24L01.17 34.44,15.48 34.49,15.53 | NRF24L01.8 35.04,14.98 | 35.04,14.98 34.99,15.03 | 35.04,14.98 35.04,14.29 34.73,13.98 NRF24L01.20 31.98,13.98 31.7,13.7 31.7,11.3 30.13,9.73 29.11,9.73 | 29.11,9.73 28.82,9.73 | 28.82,9.73 28.55,9.73 | C14.1 41.14,13.03 41.14,14.75 | 41.14,14.75 41.14,15.03 | 41.14,15.03 41.14,15.31 | 41.14,15.31 C15.1 | 28.83,5.23 28.83,9.45 | 28.83,9.45 28.83,9.72 28.82,9.73 | 28.83,9.45 28.55,9.73
  Top 0.254: 28.83,9.45 29.11,9.73 | 41.14,15.03 41.42,15.03 | 41.42,15.03 45.94,15.03 47.02,13.95 47.02,9.29 45.99,8.26 40.25,8.26 | v26.46,23.26 26.46,23.59 27.27,24.4 U1.23 27.27,29.12 | 37.13,34.96 37.13,32.55 36.87,32.28 U1.35 27.57,32.28 27.27,31.99 27.27,29.52 | 35.43,44.91 35.43,41.97 | 35.43,41.97 35.43,41.74 | 35.43,41.74 35.43,41.47 | 35.43,41.47 35.43,40.43 36.54,39.32 47.63,39.32 48.65,38.3 48.65,33.67 | C18.1 46.1,22.36 48.65,24.91 48.65,29.41 | 48.65,33.67 48.65,33.45 | 48.65,33.45 48.65,33.2 | 48.65,33.2 48.65,31.14 | 48.65,31.14 48.65,30.92 | 48.65,30.92 48.65,30.66 | 48.65,30.66 48.65,29.78 | 48.65,29.78 48.65,29.59 | 48.65,29.59 48.65,29.41 | X1.5 48.47,29.6 | 48.47,29.6 48.65,29.6 48.65,29.59 | 48.47,29.6 48.65,29.78 | 48.47,29.6 48.65,29.41 | X1.7 46.08,30.92 48.42,30.92 | 48.42,30.92 48.65,30.92 | 48.42,30.92 48.64,31.14 48.65,31.14 | 48.42,30.92 48.42,30.89 48.65,30.66 | X1.11 46.07,33.45 48.36,33.45 | 48.4,33.45 48.65,33.45 | 48.36,33.45 48.58,33.67 48.65,33.67 | 48.36,33.45 48.4,33.45 | 48.4,33.45 48.65,33.2 | U1.8 22.56,29.29 | 22.56,29.29 22.81,29.29 | 22.81,29.29 22.99,29.29 | 22.99,29.29 27.11,29.29 | 27.27,29.12 27.11,29.29 | 27.27,29.12 27.27,29.52 | U1.47 22.77,29.5 | 22.77,29.5 22.77,29.32 22.81,29.29 | 22.77,29.5 22.56,29.29 | 22.77,29.5 22.99,29.29 | 27.11,29.29 27.11,29.35 27.27,29.52 | USRLED-1.C 31.07,41.72 | 31.07,41.72 31.37,41.72 | 31.37,41.72 31.71,41.72 | 31.71,41.72 35.18,41.72 | 35.18,41.72 35.41,41.72 35.43,41.74 | 35.18,41.72 35.43,41.97 | 35.18,41.72 35.43,41.47 | 31.38,44.84 31.38,42.05 | 31.38,42.03 31.38,41.73 31.37,41.72 | 31.38,42.05 31.38,42.03 | 31.38,42.03 31.07,41.72 | 31.38,42.05 31.71,41.72
  Top 0.254: v22.05,41.74 USRLED-2.C | v12.95,23.31 R10.1 | 11.54,27.4 C8.1 | 41.42,15.03 41.14,15.31 | 41.42,15.03 41.14,14.75
  Top 0.508: R11.1 C16.1 26.05,13.18 | 26.05,13.18 26.05,11.34 C17.1 | 26.05,13.18 24.72,13.18 C27.- | C9.1 10.09,21.67 10.56,21.2 R10.1 | L-G.1 9.13,36.19 RESET.1 9.52,34.34 10.26,33.6 11.36,33.6 | 11.36,33.6 11.86,33.6 | 11.86,33.6 12.31,33.6 | 12.31,33.6 C6.1 C7.2 | 11.87,33.09 C2.- 11.87,29.86 11.58,29.57 10.61,29.57 10.08,29.04 C8.1 | 11.87,33.09 11.87,33.59 11.86,33.6 | 11.87,33.09 11.36,33.6 | 11.87,33.09 12.31,33.53 12.31,33.6 | POWER-CON.5 POWER-CON.6 | 35.43,5.01 31.44,5.01 | C18.1 C19.1 | v11.59,27.4 11.54,27.4 | v22.04,41.73 v22.05,41.74 | v37.09,35 37.13,34.96 | v22.08,21.18 22.08,21.13 | v26.46,23.25 v26.46,23.26 | v12.94,23.32 v12.95,23.31 | v40.22,8.26 40.25,8.26 | v23.52,15.4 v23.53,15.4
  Top 1.27: POWER-CON.5 28.83,5.23 | POWER-CON.6 31.44,5.01 | ESC-3.1 35.43,5.01 | L-G.1 | ESP-CON.6 31.38,44.84 | ESC-2.1 35.43,44.91
  Bottom 0.254: C1.- 25.01,15.4 v23.53,15.4 | 40.18,8.26 36.31,8.26 35.47,7.42 35.47,5.12 | 26.46,23.21 C4.2 | 37.09,35.04 37.09,38.61 37.48,39 T1.E | C10.2 5.48,38.17 5.01,37.7 L-G.1 | 13.93,39.4 19.71,39.4 v22.04,41.73 | 13.9,39.4 13.55,39.4 | 13.93,39.4 13.55,39.78 | 13.93,39.4 13.9,39.4 | 13.9,39.4 13.55,39.05 | C13.1 14.12,23.1 | 14.12,23.1 13.88,23.34 | 12.96,23.34 13.88,23.34 | 14.12,23.1 14.12,23.33 | 14.12,23.33 14.12,23.56 | 14.12,23.58 14.12,26.67 13.39,27.4 11.61,27.4 | 13.88,23.34 14.12,23.58 | 22.08,21.22 22.08,22.09 20.84,23.33 14.35,23.33 | 14.12,23.33 14.35,23.33 | 14.35,23.33 14.12,23.56 | 14.12,23.56 14.12,23.58 | 14.35,23.33 14.12,23.1
  Bottom 0.508: C4.2 C3.2 C5.2 26.45,15.63 26.26,15.44 C1.- | C13.1 C11.2 C12.2 14.13,15.52 14.65,15 15.65,15 15.93,14.72 C21.2 | T1.E 38.45,41.16 37.88,41.73 36.52,41.73 35.43,42.82 35.43,44.73 | X2.2 9.43,9.91 9.43,5.07 | 14.56,44.91 14.56,42.95 13.55,41.94 R1.2 13.55,39.78 13.55,39.4 13.55,39.05 13.55,38.21 C10.2 | v22.04,41.73 | v37.09,35 37.09,35.04 | v11.59,27.4 11.61,27.4 | v12.94,23.32 12.96,23.34 | v23.52,15.4 v23.53,15.4 | v22.08,21.18 22.08,21.22 | v26.46,23.25 26.46,23.21 | v40.22,8.26 40.18,8.26
  Bottom 1.016: X2.2 X2.3 X2.4 X2.5 9.62,16.5 10.06,16.94 C12.2
  Bottom 1.27: ESC-1.1 14.56,44.91 | ESC-2.1 35.43,44.73 | L-G.1 | ESC-4.1 9.43,5.07 | ESC-3.1 35.47,5.12
  pour Top (isolate 0.305): -4,55 -4,-5 0,-5 55,-5 55,2 55,55
  pour Bottom (isolate 0.305): -8,58 -8,-8 -1,-8 58,-8 58,-2 58,58
N$3
  Top 0.508: R6.2 25.3,41.58 USRLED-2.A
N$4
  Top 0.508: USRLED-1.A R7.2
N$5
  Top 0.254: 5.08,27.4 C8.2 R4.2
  Top 1.27: Q1.2 5.08,27.4
N$7
  Top 0.254: R11.2 30.09,17.63 30.38,17.34 30.38,16.35 30.75,15.98 NRF24L01.16
N$8
  Top 0.254: NRF24L01.19 31.33,14.48 31.04,14.19 31.04,11.85 30.4,11.21 C17.2
N$9  (via drill 0.35)
  Top 0.254: NRF24L01.13 34.99,17.89 33.71,19.17 29.67,19.17 v29.45,18.95 | 20.5,8.62 25.24,8.62
  Top 0.508: v29.44,18.94 v29.45,18.95 | v25.26,8.62 25.24,8.62 | v20.48,8.6 20.5,8.62
  Bottom 0.254: 25.29,8.62 26.36,8.62 29.44,11.7 29.44,18.89 | 20.48,8.66 L2.1
  Bottom 0.508: L2.1 L1.2 | v29.44,18.94 29.44,18.89 | v25.26,8.62 25.29,8.62 | v20.48,8.6 20.48,8.66
N$10  (via drill 0.35)
  Top 0.254: NRF24L01.12 35.49,19.44 34.89,20.04 24.53,20.04 20.74,16.25
  Top 0.508: v20.72,16.21 20.72,16.23 20.74,16.25
  Bottom 0.254: 20.68,16.21 18.9,16.21 18.47,15.78 L3.1
  Bottom 0.508: L1.1 L3.1 | v20.72,16.21 20.68,16.21
N$11  (via drill 0.35)
  Top 0.254: NRF24L01.11 35.99,17.98 36.33,18.32 38.1,18.32 38.92,19.14 C18.2 | 21.68,14.92 21.68,16.46 24.83,19.61 34.24,19.61 34.66,19.18 | 36.74,19.18 36.74,20.65 C19.2
  Top 0.508: C18.2 C19.2 | v36.74,19.15 36.74,19.18 | v34.69,19.16 34.66,19.18 | v21.68,14.87 21.68,14.92
  Bottom 0.254: 21.66,14.89 L3.2 | 36.71,19.16 34.72,19.16
  Bottom 0.508: v21.68,14.87 21.66,14.89 | v34.69,19.16 34.72,19.16 | v36.74,19.15 36.72,19.15 36.71,19.16
N$12
  Top 0.254: NRF24L01.9 39.04,15.48 39.74,14.78 39.74,11.6 40.04,11.3 C14.2 42.37,11.3 43.66,12.59 44.77,12.59
  Top 1.27: Q2.1 44.77,12.59
N$13
  Top 0.254: NRF24L01.10 38.3,15.98 38.64,16.32 38.64,18.13 39.26,18.75 C15.2 42.5,18.75 43.84,17.41 44.75,17.41
  Top 1.27: Q2.2 44.75,17.41
N$14
  Bottom 0.508: C20.1 14.25,12.66 C21.1 14.19,12.64 X2.1
  Bottom 1.5: X2.1
N$15
  Bottom 0.508: L2.2 C20.2
N$16
  Bottom 0.508: 42.49,41.2 T1.C
  Bottom 1.27: BUZZER.2 42.49,41.2
N$17
  Bottom 0.508: R8.2 T1.B
NRST  (via drill 0.35)
  Top 0.254: U1.7 17.61,29.79 16.84,29.01 16.84,28.46 | 16.84,36.58 RESET.2 | 39.83,33.41 X1.12
  Top 0.508: v16.84,28.44 16.84,28.46 | v16.84,36.55 16.84,36.58 | v39.8,33.44 39.83,33.41
  Bottom 0.254: C10.1 15.32,38.14 R3.1 16.51,35.68 | v16.84,28.45 16.84,35.35 | 16.84,35.35 16.84,35.67 | 16.84,35.67 16.84,35.96 | 16.84,36.53 16.84,35.96 | 16.56,35.68 16.83,35.68 16.84,35.67 | 16.51,35.68 16.56,35.68 | 16.56,35.68 16.84,35.96 | 16.51,35.68 16.84,35.35 | 39.8,33.41 39.8,30.11 34.99,25.3 29.11,25.3 | v16.84,28.44 16.84,26.06 17.6,25.3 28.57,25.3 | 29.11,25.3 28.85,25.3 | 28.85,25.3 28.57,25.3 | 28.84,44.79 28.84,25.57 | 28.84,25.57 28.84,25.31 28.85,25.3 | 28.84,25.57 28.57,25.3 | 28.84,25.57 29.11,25.3
  Bottom 0.508: v16.84,36.55 16.84,36.53 | v39.8,33.44 39.8,33.41 | v16.84,28.44 v16.84,28.45
  Bottom 1.27: ESP-CON.5 28.84,44.79
OSC_IN  (via drill 0.35)
  Top 0.254: U1.5 17.16,30.79 13.32,26.95 13.32,25.69 | 8.39,21.09 C9.2 Q1.1
  Top 0.508: v13.32,25.66 13.32,25.69 | v8.39,21 8.39,21.09
  Top 1.27: Q1.1
  Bottom 0.254: 13.29,25.66 9.58,25.66 8.39,24.47 8.39,21.03
  Bottom 0.508: v13.32,25.66 13.29,25.66 | v8.39,21 8.39,21.03
OSC_OUT
  Top 0.254: U1.6 17.38,30.29 14.12,27.03 14.12,25.12 13.87,24.87 R4.1
PA1-BATTERY-STATUS
  Top 0.254: R10.2 14.65,25.73 16.7,27.79 U1.11
  Top 0.508: R9.1 R10.2
PA2-MEMS-INT2
  Top 0.254: U1.12 17.2,27.29 15.53,25.62 15.53,20.79 15.95,20.37 LISH3D.9
PA3-MEMS-INT1  (via drill 0.35)
  Top 0.254: v17,19.37 LISH3D.11 | 17,21.43 17,22.34 17.72,23.06 21.27,23.06 22.27,24.06 U1.13
  Top 0.508: v17,21.38 17,21.43 | v16.99,19.36 v17,19.37
  Bottom 0.254: 16.99,19.42 v16.99,21.37
  Bottom 0.508: v17,21.38 v16.99,21.37 | v16.99,19.36 16.99,19.42
PA4-SPI1-CS0
  Top 0.254: LISH3D.8 19.05,21.89 19.81,22.65 21.54,22.65 22.77,23.88 U1.14
PA5-SPI1-SCK  (via drill 0.35)
  Top 0.254: U1.15 23.27,23.26 23.04,23.02 | 23,21.16 23,20.35 22.52,19.87 LISH3D.4
  Top 0.508: v23,21.18 23,21.16 | v22.99,22.98 23.04,23.02
  Bottom 0.254: 22.99,22.91 22.99,21.19
  Bottom 0.508: v23,21.18 22.99,21.19 | v22.99,22.98 22.99,22.91
PA6-SPI1-MISO
  Top 0.254: LISH3D.7 19.55,21.74 20.06,22.25 23.43,22.25 23.77,22.59 U1.16
PA7-SPI1-MOSI
  Top 0.254: LISH3D.6 20.05,21.51 20.38,21.84 23.69,21.84 24.27,22.42 U1.17
PA8-NRF-CE  (via drill 0.35)
  Top 0.254: U1.29 32.83,29.29 34.46,27.65 34.46,26.35 | 30.89,20.78 v30.89,26.32 | 30.93,8.52 30.93,9.48 31.4,9.95 33.52,9.95 33.99,10.42 NRF24L01.1
  Top 0.508: v34.46,26.33 34.46,26.35 | v30.89,26.33 v30.89,26.32 | v30.93,20.74 30.89,20.78 | v30.93,8.48 30.93,8.52
  Bottom 0.254: 34.44,26.33 30.91,26.33 | 30.93,8.52 30.93,20.71
  Bottom 0.508: v30.93,20.74 30.93,20.71 | v30.89,26.33 30.91,26.33 | v34.46,26.33 34.44,26.33 | v30.93,8.48 30.93,8.52
PA9-TX  (via drill 0.35)
  Top 0.254: U1.30 33.58,29.79 35.2,28.16 35.2,27.04 | 21.22,45.06 21.22,46.59 21.61,46.98 25.13,46.98
  Top 0.508: v35.2,27.01 35.2,27.04 | v25.15,46.98 25.13,46.98
  Top 1.27: ESP-CON.2 21.22,45.06
  Bottom 0.254: 35.2,27.03 35.2,38.7 33.28,40.62 33.28,45.99 32.29,46.98 25.21,46.98
  Bottom 0.508: v25.15,46.98 25.21,46.98 | v35.2,27.01 35.2,27.03
PA10-RX  (via drill 0.35)
  Top 0.254: U1.31 34.6,30.29 35.91,28.98 35.91,27.73
  Top 0.508: v35.91,27.69 35.91,27.73
  Bottom 0.254: 35.91,27.74 35.91,39.19 33.83,41.27 33.83,46.46 32.62,47.67 24.2,47.67 23.76,47.23 23.76,45.23
  Bottom 0.508: v35.91,27.69 35.91,27.74
  Bottom 1.27: ESP-CON.3 23.76,45.23
PA11-BUZZER  (via drill 0.35)
  Top 0.254: U1.32 34.95,30.79 36.61,29.12 36.61,28.37
  Top 0.508: v36.61,28.32 36.61,28.37
  Bottom 0.254: 36.61,28.35 36.61,30.14 38.65,32.18 R8.1
  Bottom 0.508: v36.61,28.32 36.61,28.35
PA12-NRF-IRQ  (via drill 0.35)
  Top 0.254: U1.33 36.72,31.29 37.34,30.66 37.34,28.02 34.51,25.19 34.51,21.48 | 37.46,11.6 38.49,11.6 38.83,11.94 38.83,13.58 38.43,13.98 NRF24L01.6
  Top 0.508: v34.51,21.42 34.51,21.48 | v37.42,11.6 37.46,11.6
  Bottom 0.254: 34.53,21.42 36.77,21.42 37.4,20.79 37.4,11.62
  Bottom 0.508: v34.51,21.42 34.53,21.42 | v37.42,11.6 37.4,11.62
PB4-LED-1
  Top 0.254: U1.40 26.27,35.59 27.65,36.97 R7.1
PB5-LED-2
  Top 0.254: U1.41 25.77,35.69 25.3,36.16 R6.1
PB8-TIM4-CH3
  Top 0.254: U1.45 23.77,38.68 19.9,42.55 19.9,46.75 20.95,47.8 37.33,47.8 37.97,47.16 37.97,45.26
  Top 1.27: ESC-2.2 37.97,45.26
PB9-TIM4-CH4  (via drill 0.35)
  Top 0.254: U1.46 23.27,38.35 19.66,41.96 v12.02,41.96
  Top 0.508: v12.01,41.96 v12.02,41.96
  Bottom 0.254: 12.02,41.97 12.02,44.83
  Bottom 0.508: v12.01,41.96 12.02,41.97
  Bottom 1.27: ESC-1.2 12.02,44.83
PB10-TIM2-CH3  (via drill 0.35)
  Top 0.254: U1.21 26.27,24.88 24.86,23.47 24.86,21.5 23.8,20.43 | 17.04,18.12 16.12,18.12 15.89,17.89 15.89,4.6 17.35,3.14 20.09,3.14 | 38.01,4.76 38.01,3.31 37.8,3.1 33.45,3.1
  Top 0.508: v23.78,20.42 23.8,20.43 | v17.07,18.12 17.04,18.12 | v20.11,3.14 20.09,3.14 | v33.41,3.14 33.45,3.1
  Top 1.27: ESC-3.2 38.01,4.76
  Bottom 0.254: v23.77,20.41 22.62,19.26 21.42,19.26 20.28,18.12 17.12,18.12 | 33.34,3.14 20.13,3.14
  Bottom 0.508: v17.07,18.12 17.12,18.12 | v23.78,20.42 v23.77,20.41 | v20.11,3.14 20.13,3.14 | v33.41,3.14 33.34,3.14
PB11-TIM2-CH4  (via drill 0.35)
  Top 0.254: U1.22 26.77,24.73 25.39,23.35 25.39,20.93
  Top 0.508: v25.39,20.89 25.39,20.93
  Bottom 0.254: 25.39,20.84 25.39,17.37 24.64,16.62 22.98,16.62 22.63,16.27 22.63,8.37 21.68,7.42 12.69,7.42 11.97,6.7 11.97,5.04
  Bottom 0.508: v25.39,20.89 25.39,20.84
  Bottom 1.27: ESC-4.2 11.97,5.04
PB12-SPI2-CS0  (via drill 0.35)
  Top 0.254: U1.25 31.05,27.29 31.64,26.69 31.64,21.52 | 31.68,9.19 33.76,9.19 34.49,9.92 NRF24L01.2
  Top 0.508: v31.64,21.5 31.64,21.52 | v31.64,9.19 31.68,9.19
  Bottom 0.254: 31.64,9.23 31.64,21.45
  Bottom 0.508: v31.64,21.5 31.64,21.45 | v31.64,9.19 31.64,9.23
PB13-SPI2-SCK  (via drill 0.35)
  Top 0.254: U1.26 31.57,27.79 32.31,27.04 v32.31,22.17 | 32.32,8.52 34.12,8.52 34.99,9.39 NRF24L01.3
  Top 0.508: v32.31,22.16 v32.31,22.17 | v32.3,8.52 32.32,8.52
  Bottom 0.254: v32.31,8.52 32.31,22.13
  Bottom 0.508: v32.31,22.16 32.31,22.13 | v32.3,8.52 v32.31,8.52
PB14-SPI2-MISO  (via drill 0.35)
  Top 0.254: U1.27 31.98,28.29 33.01,27.25 33.01,21.44 | 33.04,7.01 34.84,7.01 35.99,8.16 NRF24L01.5
  Top 0.508: v33.01,21.42 33.01,21.44 | v33,7.01 33.04,7.01
  Bottom 0.254: v33.01,7.02 33.01,21.35
  Bottom 0.508: v33.01,21.42 33.01,21.35 | v33,7.01 v33.01,7.02
PB15-SPI2-MOSI  (via drill 0.35)
  Top 0.254: U1.28 32.38,28.79 33.73,27.44 33.73,22.17 | 33.8,7.78 34.63,7.78 35.49,8.64 NRF24L01.4
  Top 0.508: v33.73,22.15 33.73,22.17 | v33.71,7.78 33.8,7.78
  Bottom 0.254: 33.73,7.8 33.73,22.11
  Bottom 0.508: v33.73,22.15 33.73,22.11 | v33.71,7.78 33.73,7.8
SWCLK
  Top 0.254: U1.37 27.77,35.6 28.36,36.19 37.64,36.19 38.34,35.49 38.34,30.11 38.91,29.54 42.27,29.54 X1.6
SWDIO
  Top 0.254: U1.34 37.23,31.79 37.84,31.18 37.84,28.82 38.33,28.33 X1.4
SWO
  Top 0.254: U1.39 26.77,35.42 28.07,36.72 37.96,36.72 38.86,35.82 38.86,31.51 39.5,30.87 X1.8

### Text on the board
bPlace: TH . GruzzJLyy | Design By